# EAGLE schematic Amstrad-CPC-2855-PIO-Test-1-0 (EAGLE 9.6.2)
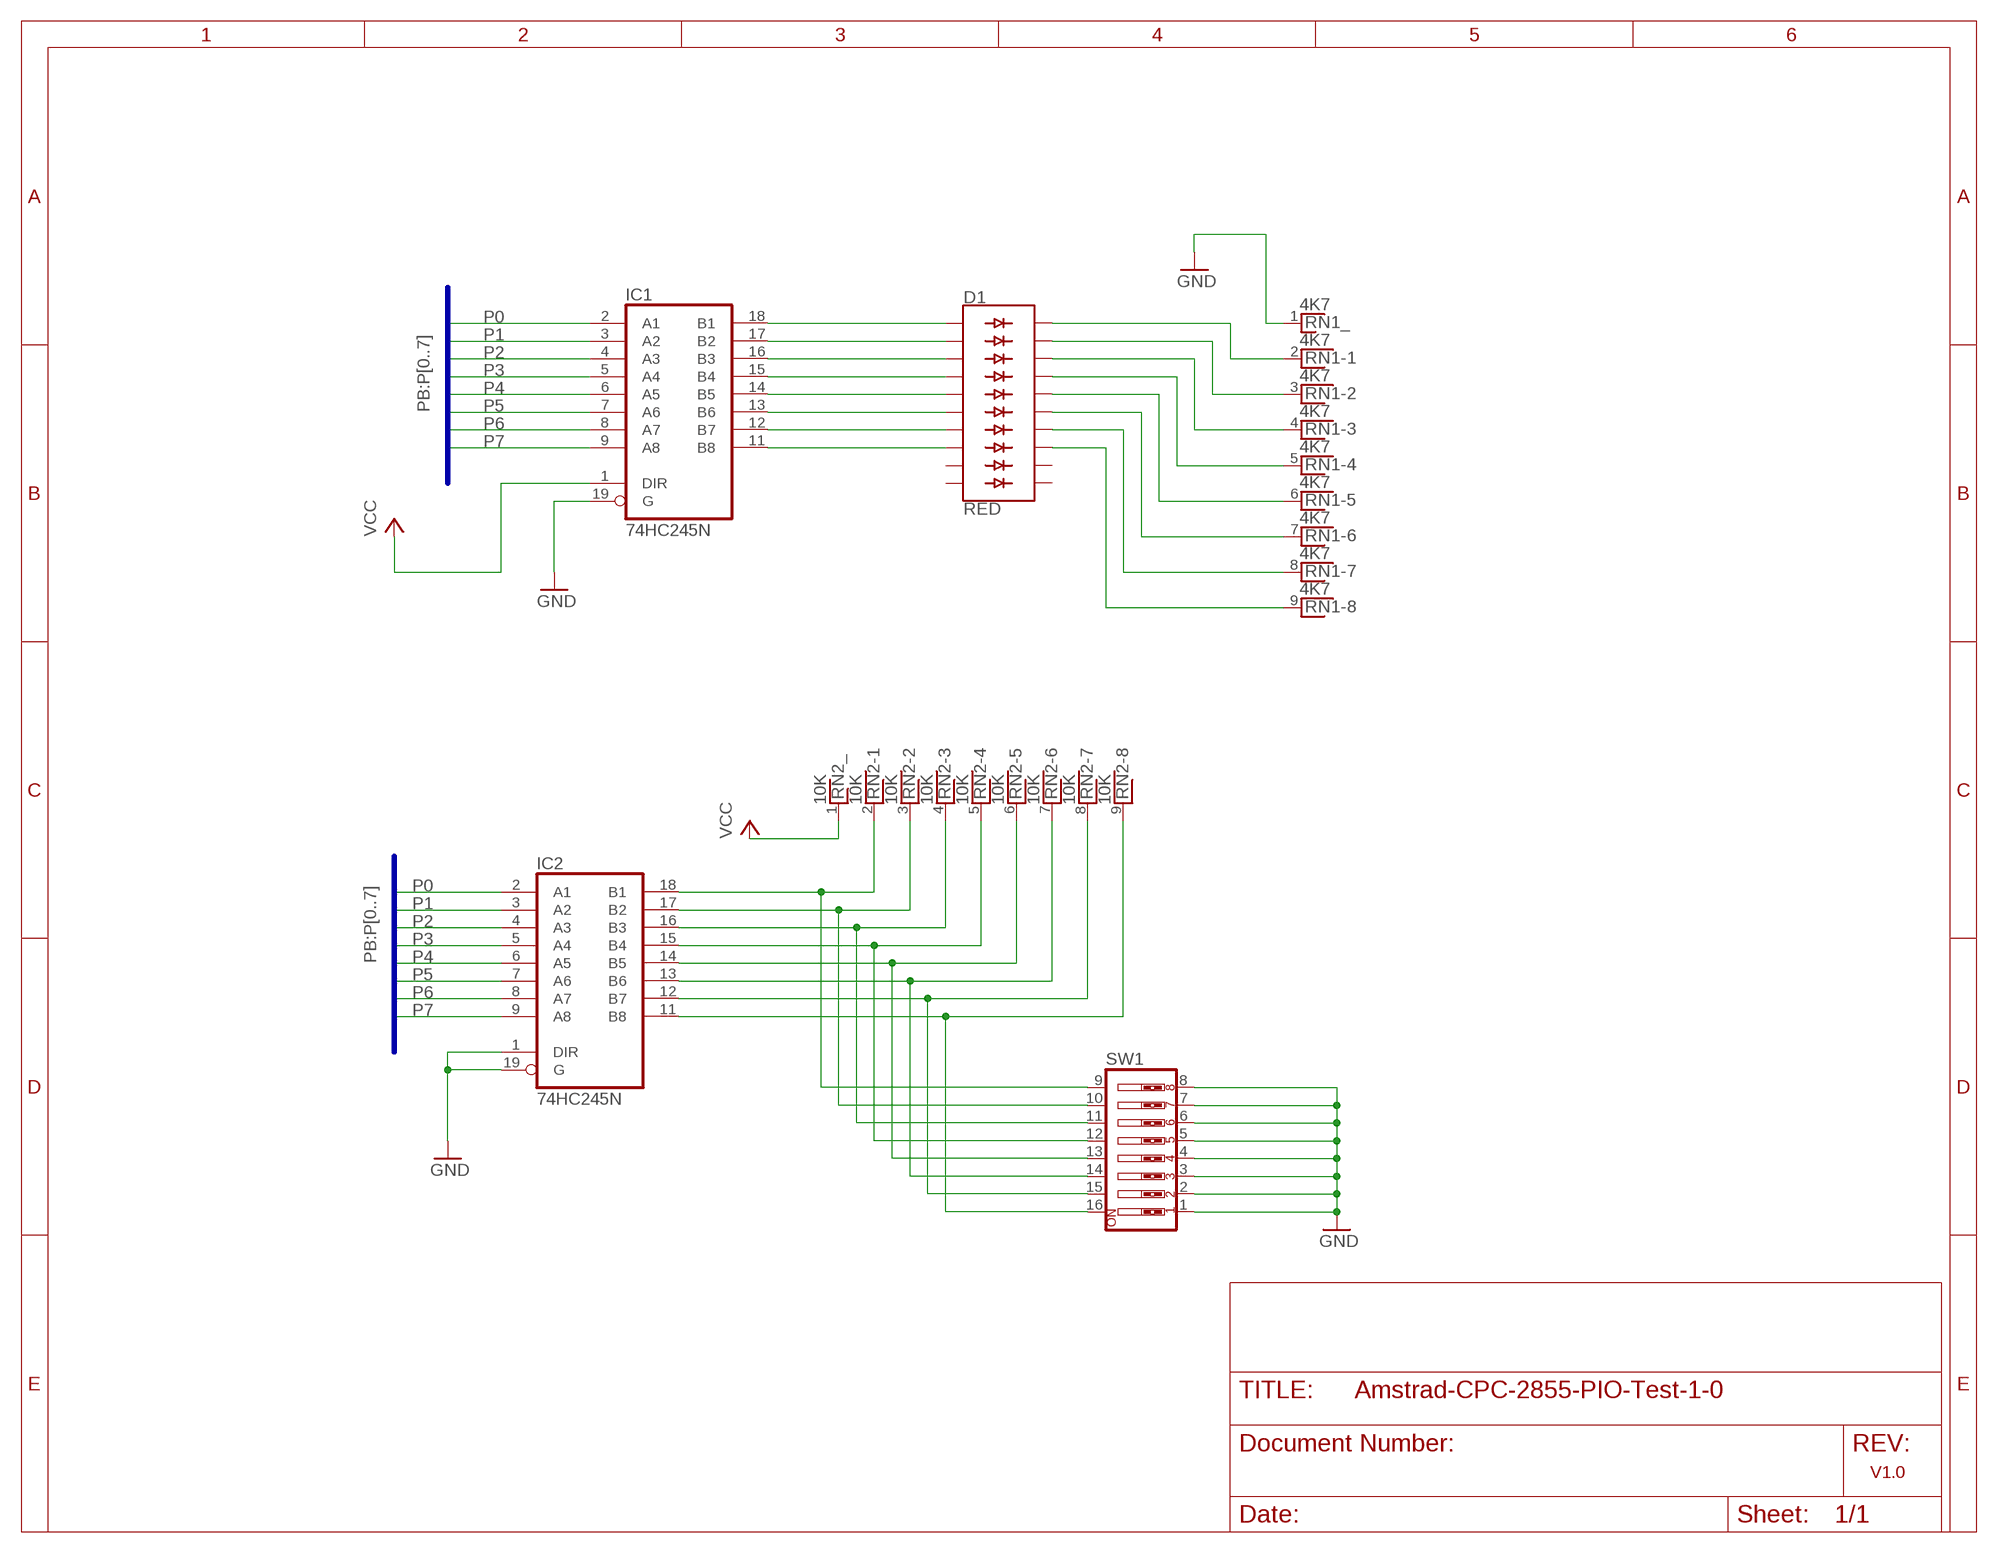
[diagram p0: schematic, sheet 1]

## Parts
D1  RED  LED_BARGRAPH_10RED  [LED_BARGRAPH_10]
IC1  74HC245N  [DIL20]
IC2  74HC245N  [DIL20]
RN1  4K7  RNX8  [RN-9]
RN2  10K  RNX8  [RN-9]
SW1  SW_DIP-8  [EDG-08]

## Nets
GND: IC1.19(G) IC2.1(DIR) IC2.19(G) RN1.1 SW1.1 SW1.2 SW1.3 SW1.4 SW1.5 SW1.6 SW1.7 SW1.8
N$1: D1.20(C) RN1.2
N$2: D1.1(A) IC1.18(B1)
N$3: D1.19(C1) RN1.3
N$4: D1.18(C2) RN1.4
N$5: D1.17(C3) RN1.5
N$6: D1.16(C4) RN1.6
N$7: D1.15(C5) RN1.7
N$8: D1.14(C6) RN1.8
N$9: D1.13(C7) RN1.9
N$10: D1.2(A1) IC1.17(B2)
N$11: D1.3(A2) IC1.16(B3)
N$12: D1.4(A3) IC1.15(B4)
N$13: D1.5(A4) IC1.14(B5)
N$14: D1.6(A5) IC1.13(B6)
N$15: D1.7(A6) IC1.12(B7)
N$16: D1.8(A7) IC1.11(B8)
N$17: IC2.18(B1) RN2.2 SW1.9
N$18: IC2.17(B2) RN2.3 SW1.10
N$19: IC2.16(B3) RN2.4 SW1.11
N$20: IC2.15(B4) RN2.5 SW1.12
N$21: IC2.14(B5) RN2.6 SW1.13
N$22: IC2.13(B6) RN2.7 SW1.14
N$23: IC2.12(B7) RN2.8 SW1.15
N$24: IC2.11(B8) RN2.9 SW1.16
P0: IC1.2(A1) IC2.2(A1)
P1: IC1.3(A2) IC2.3(A2)
P2: IC1.4(A3) IC2.4(A3)
P3: IC1.5(A4) IC2.5(A4)
P4: IC1.6(A5) IC2.6(A5)
P5: IC1.7(A6) IC2.7(A6)
P6: IC1.8(A7) IC2.8(A7)
P7: IC1.9(A8) IC2.9(A8)
VCC: IC1.1(DIR) RN2.1
Unconnected: D1.9(A8) D1.10(A9) D1.11(C9) D1.12(C8)

## Buses
PB:P[0..7]

## Notes on the sheet
- V1.0

## Power pins joined to a net without a drawn wire
GND: IC1.10(GND) IC2.10(GND)
VCC: IC1.20(VCC) IC2.20(VCC)

## Library data of the parts
D1 = SparkFun-LED:LED_BARGRAPH_10: Young Sun LED Tech - YSLB-10251G5-10 10-Segment LED Bar Graph Features: Red Vf = 2.1V, Ifmax = 20mA Yellow Vf = 2.1V, Ifmax = 20mA Blue Vf = 3.4V, Ifmax = 20mA Green Vf = 3.4V, Ifmax = 20mA SparkFun Products: Red <https://www.sparkfun.com/products/9935> Yellow <https://www.sparkfun.com/products/9936> Green <https://www.sparkfun.com/products/9938> Blue <https://www.sparkfun.com/products/9937>; PROD_ID: DIO-10615
IC1 IC2 = 74xx-eu:74*245: Octal BUS TRANSCEIVER, 3-state
RN1 RN2 = resistor-net:RNX8: RESISTOR NETWORK; OC_FARNELL: unknown; OC_NEWARK: unknown
SW1 = special:SW_DIP-8: DIP SWITCH